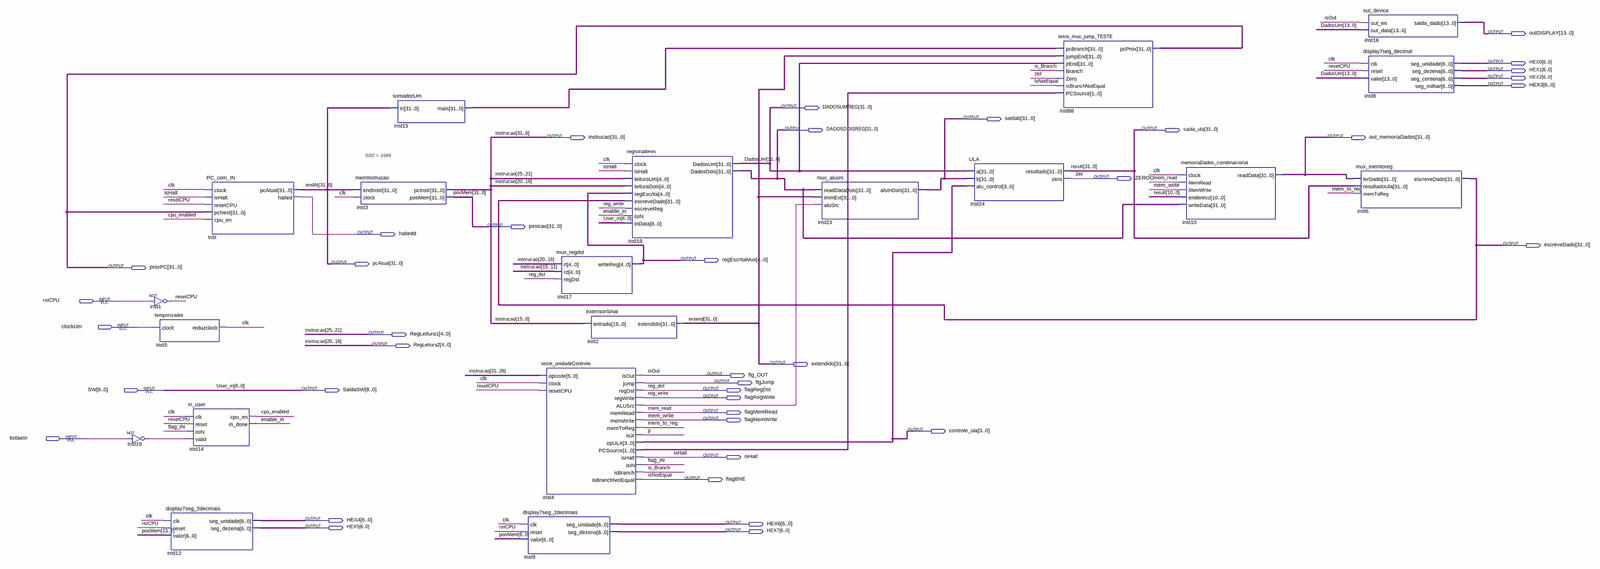
[diagram p0: schematic sheet, whole]
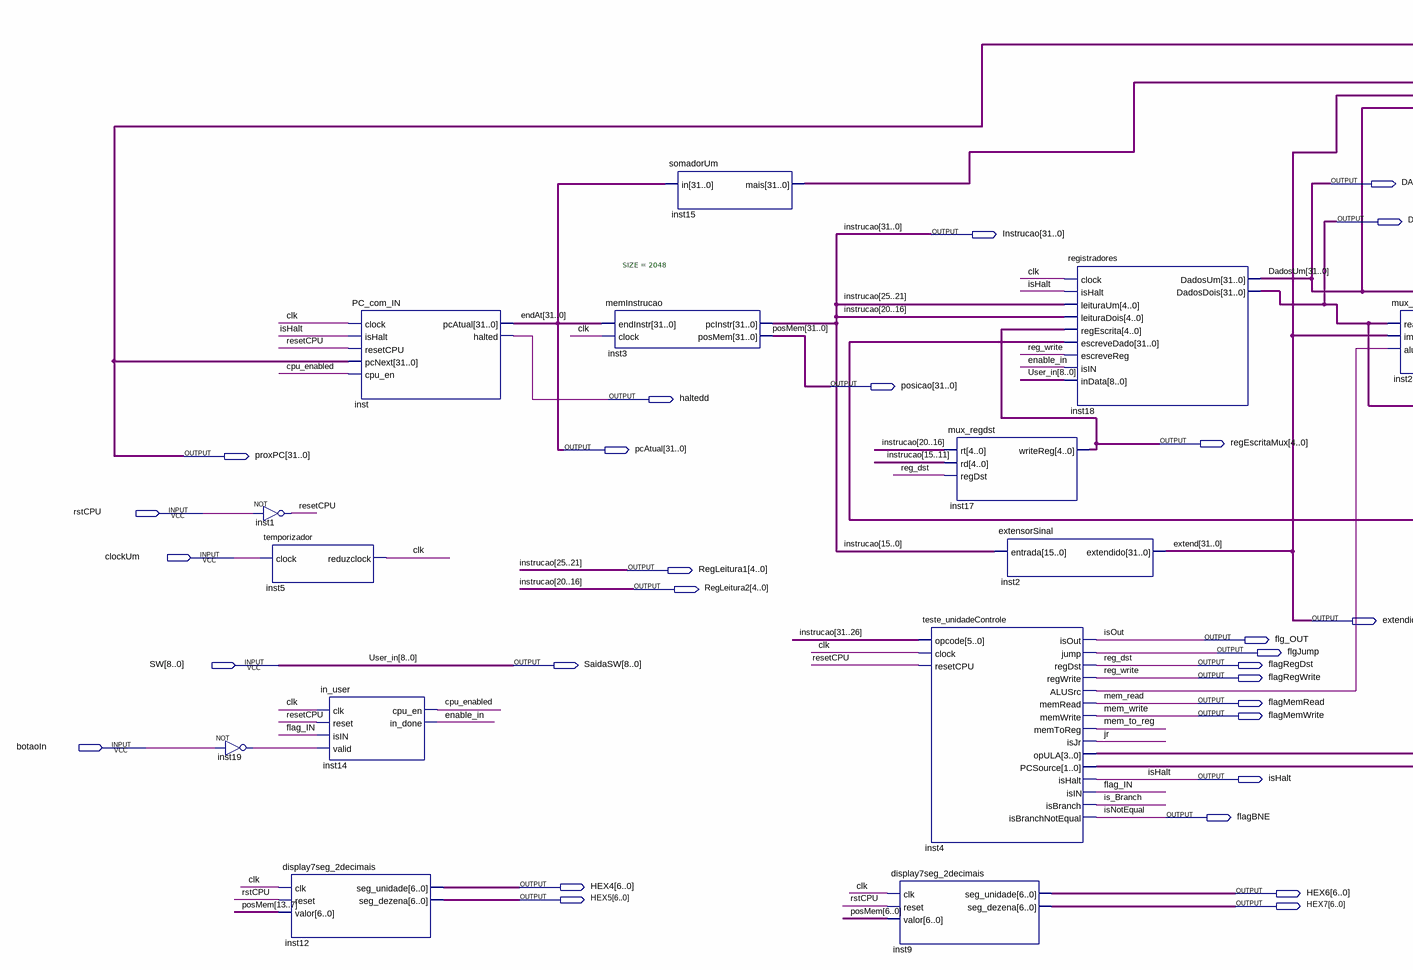
[diagram p1: schematic sheet, left part]
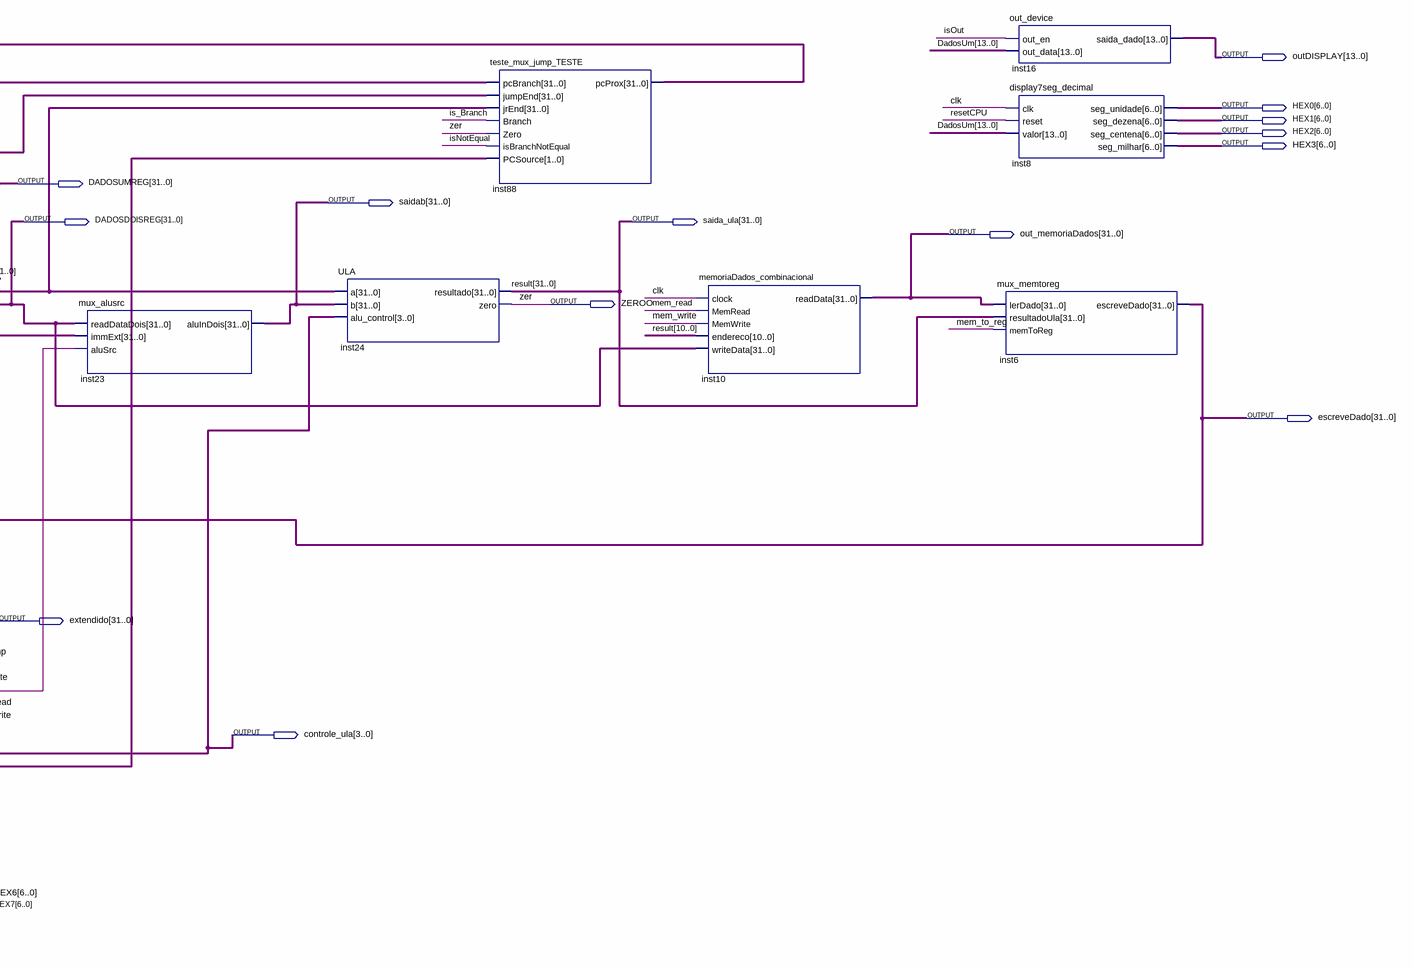
[diagram p2: schematic sheet, right part]
// Quartus schematic testeComponentes.bdf as structural Verilog: 20 symbols, 39 pins
module testeComponentes (
  input  rstCPU,
  input  clockUm,
  input  [8:0] SW,
  input  botaoIn,
  output [13:0] outDISPLAY,
  output [6:0] HEX0,
  output [6:0] HEX1,
  output [6:0] HEX2,
  output [6:0] HEX3,
  output [31:0] DADOSUMREG,
  output [31:0] saidab,
  output [31:0] DADOSDOISREG,
  output [31:0] saida_ula,
  output [31:0] Instrucao,
  output [31:0] out_memoriaDados,
  output ZEROO,
  output [31:0] posicao,
  output haltedd,
  output [31:0] escreveDado,
  output [4:0] regEscritaMux,
  output [31:0] pcAtual,
  output [31:0] proxPC,
  output [4:0] RegLeitura1,
  output [4:0] RegLeitura2,
  output [31:0] extendido,
  output flg_OUT,
  output flgJump,
  output [8:0] SaidaSW,
  output flagRegDst,
  output flagRegWrite,
  output flagMemRead,
  output flagMemWrite,
  output [3:0] controle_ula,
  output isHalt,
  output flagBNE,
  output [6:0] HEX4,
  output [6:0] HEX6,
  output [6:0] HEX5,
  output [6:0] HEX7
);

  wire clk, cpu_enabled, enable_in, flag_IN, inst4_alusrc, inst19_out, is_Branch, jr, mem_to_reg, resetCPU;
  wire [1:0] inst4_pcsource;
  wire [31:0] inst15_mais;

  not inst19 (inst19_out, botaoIn);
  not inst1 (resetCPU, rstCPU);
  temporizador inst5 (.clock(clockUm), .reduzclock(clk));
  display7seg_2decimais inst12 (
    .clk(clk), .reset(rstCPU), .valor(posicao[13:7]), .seg_unidade(HEX4), .seg_dezena(HEX5));
  in_user inst14 (
    .clk(clk), .reset(resetCPU), .isIN(flag_IN), .valid(inst19_out), .cpu_en(cpu_enabled), .in_done(enable_in));
  PC_com_IN inst (
    .clock(clk), .isHalt(isHalt), .resetCPU(resetCPU), .pcNext(proxPC), .cpu_en(cpu_enabled),
    .pcAtual(pcAtual), .halted(haltedd));
  memInstrucao #(.SIZE(2048)) inst3 (.endInstr(pcAtual), .clock(clk), .pcInstr(Instrucao), .posMem(posicao));
  somadorUm inst15 (.in(pcAtual), .mais(inst15_mais));
  display7seg_2decimais inst9 (.clk(clk), .reset(rstCPU), .valor(posicao[6:0]), .seg_unidade(HEX6), .seg_dezena(HEX7));
  mux_regdst inst17 (.rt(Instrucao[20:16]), .rd(Instrucao[15:11]), .regDst(flagRegDst), .writeReg(regEscritaMux));
  teste_unidadeControle inst4 (
    .opcode(Instrucao[31:26]), .clock(clk), .resetCPU(resetCPU), .isOut(flg_OUT), .jump(flgJump),
    .regDst(flagRegDst), .regWrite(flagRegWrite), .ALUSrc(inst4_alusrc), .memRead(flagMemRead),
    .memWrite(flagMemWrite), .memToReg(mem_to_reg), .isJr(jr), .opULA(controle_ula),
    .PCSource(inst4_pcsource), .isHalt(isHalt), .isIN(flag_IN), .isBranch(is_Branch),
    .isBranchNotEqual(flagBNE));
  extensorSinal inst2 (.entrada(Instrucao[15:0]), .extendido(extendido));
  registradores inst18 (
    .clock(clk), .isHalt(isHalt), .leituraUm(Instrucao[25:21]), .leituraDois(Instrucao[20:16]),
    .regEscrita(regEscritaMux), .escreveDado(escreveDado), .escreveReg(flagRegWrite), .isIN(enable_in),
    .inData(SW), .DadosUm(DADOSUMREG), .DadosDois(DADOSDOISREG));
  mux_alusrc inst23 (.readDataDois(DADOSDOISREG), .immExt(extendido), .aluSrc(inst4_alusrc), .aluInDois(saidab));
  ULA inst24 (.a(DADOSUMREG), .b(saidab), .alu_control(controle_ula), .resultado(saida_ula), .zero(ZEROO));
  teste_mux_jump_TESTE inst88 (
    .pcBranch(inst15_mais), .jumpEnd(extendido), .jrEnd(DADOSUMREG), .Branch(is_Branch), .Zero(ZEROO),
    .isBranchNotEqual(flagBNE), .PCSource(inst4_pcsource), .pcProx(proxPC));
  memoriaDados_combinacional inst10 (
    .clock(clk), .MemRead(flagMemRead), .MemWrite(flagMemWrite), .endereco(saida_ula[10:0]),
    .writeData(DADOSDOISREG), .readData(out_memoriaDados));
  out_device inst16 (.out_en(flg_OUT), .out_data(DADOSUMREG[13:0]), .saida_dado(outDISPLAY));
  display7seg_decimal inst8 (
    .clk(clk), .reset(resetCPU), .valor(DADOSUMREG[13:0]), .seg_unidade(HEX0), .seg_dezena(HEX1),
    .seg_centena(HEX2), .seg_milhar(HEX3));
  mux_memtoreg inst6 (
    .lerDado(out_memoriaDados), .resultadoUla(saida_ula), .memToReg(mem_to_reg), .escreveDado(escreveDado));

  assign RegLeitura1 = Instrucao[25:21];
  assign RegLeitura2 = Instrucao[20:16];
  assign SaidaSW = SW;

  // Other names for the same wires on the sheet: DadosUm[31:0] = DADOSUMREG; extend[31:0] = extendido;
  //   isNotEqual = flagBNE; isOut = flg_OUT; mem_read = flagMemRead; mem_write = flagMemWrite; endAt[31:0] = pcAtual;
  //   posMem[31:0] = posicao; reg_dst = flagRegDst; reg_write = flagRegWrite; result[31:0] = saida_ula;
  //   User_in[8:0] = SW; zer = ZEROO
endmodule
